# Altium schematic sheet Blank schem.SchDoc
size A4; SheetNumber: 2; SheetTotal: 2
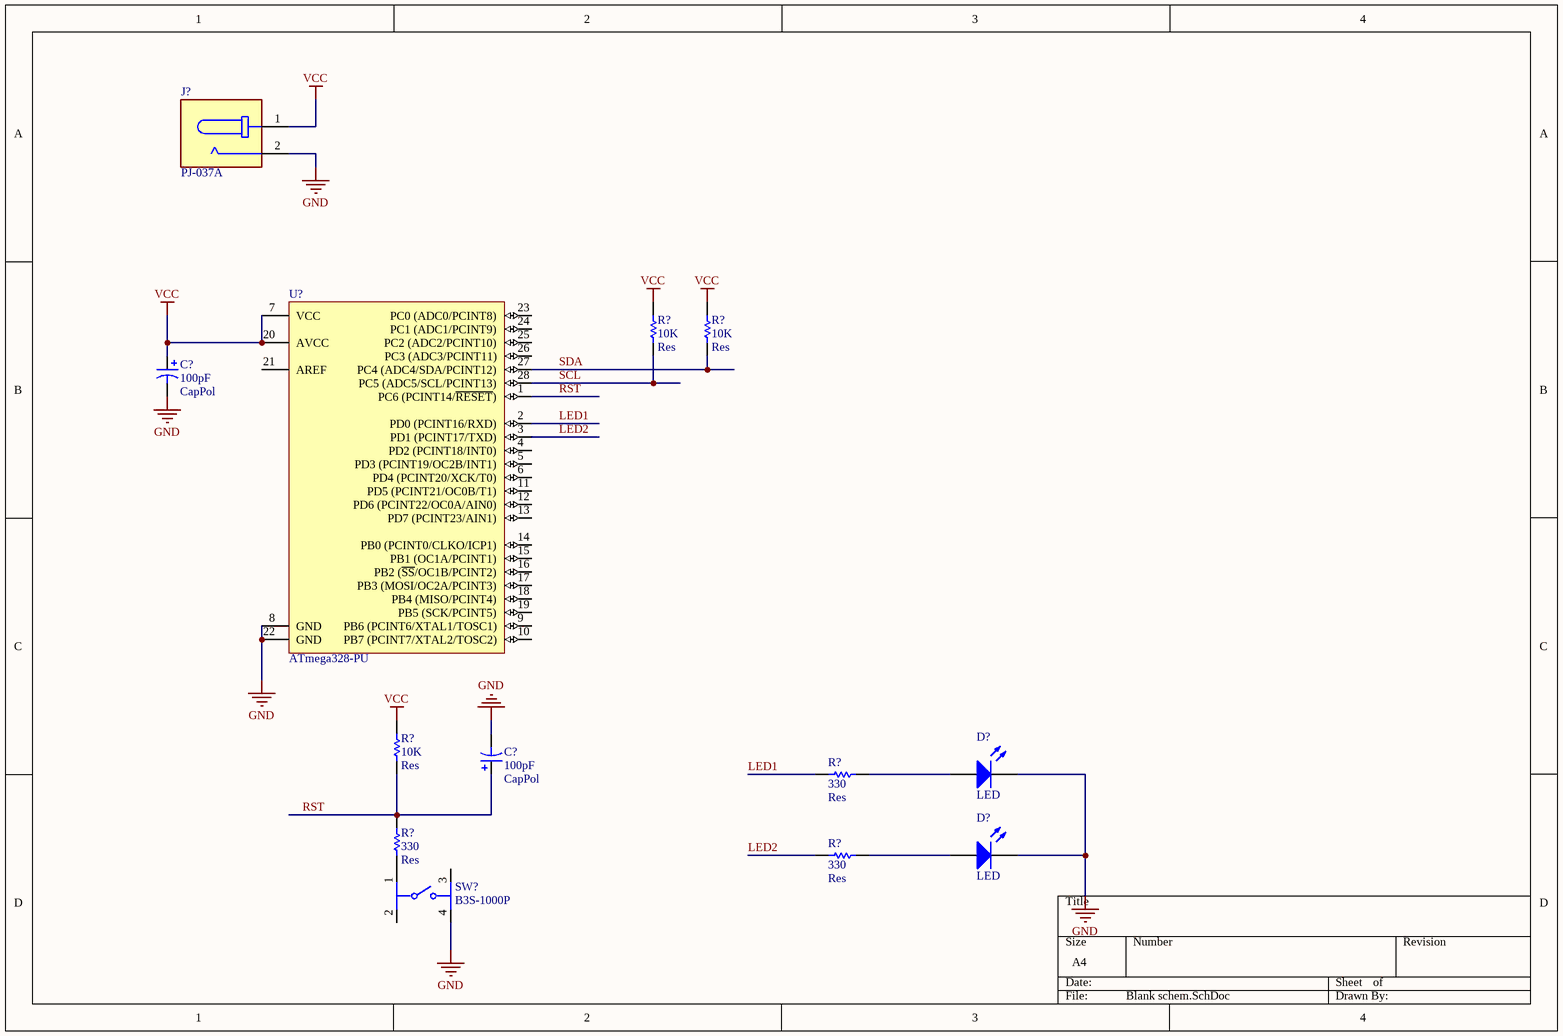
[diagram p0: Blank schem.SchDoc]

## Parts
(Parts that share a designator on the sheet are numbered #1, #2 ... from top to bottom, then left to right.)
C?#1  CapPol  value 100pF  [ElectroCap]
C?#2  CapPol  value 100pF  [ElectroCap]
D?#1  LED  [LED]
D?#2  LED  [LED]
J?  PJ-037A  [CUI_PJ-037A]
R?#1  Res  value 10K  [AXIAL-0.4]
R?#2  Res  value 10K  [AXIAL-0.4]
R?#3  Res  value 10K  [AXIAL-0.4]
R?#4  Res  value 330  [AXIAL-0.4]
R?#5  Res  value 330  [AXIAL-0.4]
R?#6  Res  value 330  [AXIAL-0.4]
SW?  B3S-1000P  [FP-B3S-1000P-MFG]
U?  ATmega328-PU  [28P3]

## Nets
GND: C?#1.2 C?#2.2 D?#1.2(K) D?#2.2(K) J?.2 SW?.4 U?.8(GND) U?.22(GND)
VCC: C?#1.1 J?.1 R?#1.2 R?#2.2 R?#3.2 U?.7(VCC) U?.20(AVCC)
LED1: R?#4.2 U?.2(PD0_(PCINT16/RXD))
LED2: R?#6.2 U?.3(PD1_(PCINT17/TXD))
RST: C?#2.1 R?#3.1 R?#5.2 U?.1(PC6_(PCINT14/~{RESET}))
SCL: R?#1.1 U?.28(PC5_(ADC5/SCL/PCINT13))
SDA: R?#2.1 U?.27(PC4_(ADC4/SDA/PCINT12))
NetD?#1_1: D?#1.1(A) R?#4.1
NetD?#2_1: D?#2.1(A) R?#6.1
NetR?#5_1: R?#5.1 SW?.1

Not connected (* = marked no-connect by the designer): SW? 2 3; U? 4(PD2_(PCINT18/INT0)) 5(PD3_(PCINT19/OC2B/INT1)) 6(PD4_(PCINT20/XCK/T0)) 9(PB6_(PCINT6/XTAL1/TOSC1)) 10(PB7_(PCINT7/XTAL2/TOSC2)) 11(PD5_(PCINT21/OC0B/T1)) 12(PD6_(PCINT22/OC0A/AIN0)) 13(PD7_(PCINT23/AIN1)) 14(PB0_(PCINT0/CLKO/ICP1)) 15(PB1_(OC1A/PCINT1)) 16(PB2_(~{SS}/OC1B/PCINT2)) 17(PB3_(MOSI/OC2A/PCINT3)) 18(PB4_(MISO/PCINT4)) 19(PB5_(SCK/PCINT5)) 21(AREF) 23(PC0_(ADC0/PCINT8)) 24(PC1_(ADC1/PCINT9)) 25(PC2_(ADC2/PCINT10)) 26(PC3_(ADC3/PCINT11))

## Library data of the parts
C?#1 C?#2 = CapPol: Polarized Capacitor (Axial); Published: 8-Jun-2000; LatestRevisionDate: 17-Jul-2002; LatestRevisionNote: Re-released for DXP Platform.; PackageReference: POLAR0.8; Publisher: Altium Limited; PackageDescription: Polarized Capacitor; 2 Leads
J? = PJ-037A: MF: {'manufacturer': u'CUI'}; Package: None; Price: None; Value: *; MP: PJ-037A; Availability: Unavailable
R?#1-R?#6 = Res: Resistor; Published: 8-Jun-2000; LatestRevisionDate: 17-Jul-2002; LatestRevisionNote: Re-released for DXP Platform.; PackageReference: AXIAL-0.3; Publisher: Altium Limited; PackageDescription: Axial Device, Thru-Hole; 2 Leads; 0.3 in Pin Spacing
SW? = CMP-08834-000008-1: SWITCH TACTILE SPST-NO 0.05A 24V; Throw Configuration: SPST; Switch Function: Off-Mom; Switch Travel: 0.25mm; Contact Current Rating: 50mA; Actuator Length: 0.8mm; Mechanical Life: 500000Cycles; Contact Resistance: 100mR; Operating Force: 1.57N; Actuator Type: Standard; Illumination Type: Non-Illuminated; Ratings: IP67; Number of Poles: 1; Package Quantity: 1; Orientation: Straight; REACH SVHC: No SVHC; Lead Free: Lead Free; Max Current Rating: 50mA; Contact Plating: Silver; Current Rating: 50mA; Depth: 9mm; Contact Material: Bronze; Electrical Life: 500000Cycles; Termination: Gull Wing; Width: 6mm; Packaging: Tape and Reel; Min Operating Temperature: -25°C; Radiation Hardening: No; Max Voltage Rating (DC): 24V; Max Operating Temperature: 70°C; Length: 6.6mm; Height: 3.65mm; Voltage Rating (DC): 24V; Weight: 0.010582oz; Mount: Surface Mount
U? = CMP-0095-00015-2: 8-bit AVR Microcontroller, 32KB Flash, 1KB EEPROM, 2KB SRAM, 28-pin PDIP, Industrial Grade (-40°C to 85°C); ComponentLink3Description: ATmega48A/48PA/88A/88PA/168A/168PA/328/328P Summary; RevisionNote: DatasheetVersion updated. URLs added.; DatasheetVersion: revD, May-2011; ComponentLink1URL: http://www.atmel.com/; PackageVersion: revB, Sep-2001; PackageDescription: 28-lead (0.300"/7.62mm Wide) Plastic Dual Inline Package (PDIP); PackageReference: 28P3; ComponentLink1Description: Manufacturer URL; ComponentLink2Description: ATmega48A/48PA/88A/88PA/168A/168PA/328/328P Datasheet; ComponentLink3URL: http://www.atmel.com/dyn/resources/prod_documents/8271S.pdf; ComponentLink2URL: http://www.atmel.com/dyn/resources/prod_documents/8271.pdf
D?#1 D?#2 = LED: Published: 8-Jun-2000; LatestRevisionDate: 08-Jul-2005; LatestRevisionNote: Mech Layer 1 removed.; PackageReference: LED-1; Publisher: Altium Limited; PackageDescription: LED; 2 Leads